# Altium schematic sheet Board_PB_LED.SchDoc
size A4
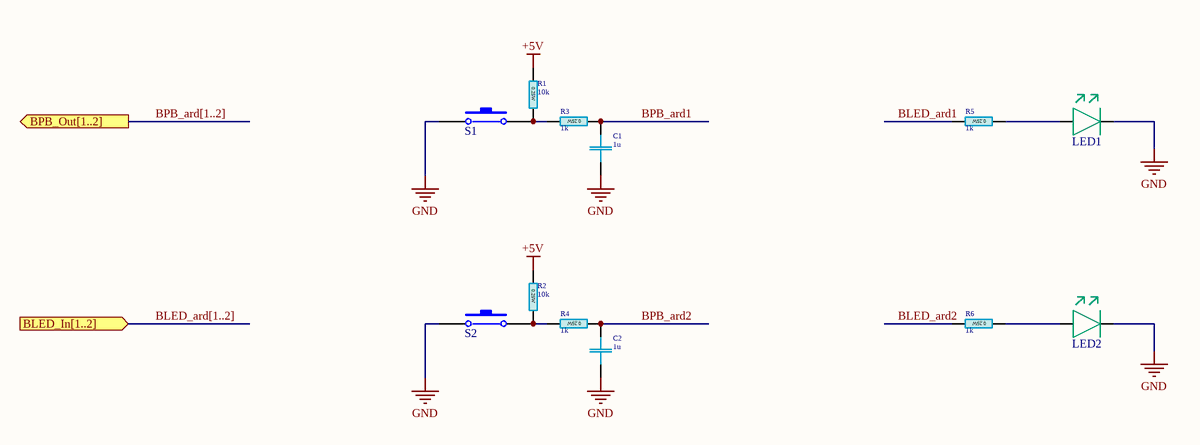
[diagram p0: Board_PB_LED.SchDoc]

## Parts
C1  1u  [C1206]
C2  1u  [C1206]
LED1  LED  [LED 1206]  (value not drawn)
LED2  LED  [LED 1206]  (value not drawn)
R1  10k  [R1206]
R2  10k  [R1206]
R3  1k  [R1206]
R4  1k  [R1206]
R5  1k  [R1206]
R6  1k  [R1206]
S1  PB-2pin  [PB-2pin]  (value not drawn)
S2  PB-2pin  [PB-2pin]  (value not drawn)

## Ports
BLED_In[1..2] (in), BPB_Out[1..2] (out)

## Nets
+5V: R1.1 R2.1
GND: C1.2 C2.2 LED1.K LED2.K S1.1 S2.1
BLED_ard1: R5.2
BLED_ard2: R6.2
BPB_ard1: C1.1 R3.1
BPB_ard2: C2.1 R4.1
NetLED1_A: LED1.A R5.1
NetLED2_A: LED2.A R6.1
NetR1_2: R1.2 R3.2 S1.2
NetR2_2: R2.2 R4.2 S2.2

## Buses and harness runs
bus BLED_ard[1..2] = port BLED_In[1..2]
bus BPB_ard[1..2] = port BPB_Out[1..2]

## Library data of the parts
C1 C2 = C 1206  100V X7R - 100n: SMD 1206   100V X7R 10%; Part Number: CL31B104KCFNNNE; Manufacturer: Samsung; TYPE: Capacitors; Package-mm: 3216; Mount Type: SMT; Publisher: Hefest; Manufacturer Alternate: *; Part Number Alternate: *; Published: 07.04.2019; Supplier 1: Comet; Supplier Part Number 1: C1206 100nF 100V X7R SAMSUNG; RoHS: Y; Technology: Ceramic  MLCC; Package: 1206; VDC: 100V; TempCo: X7R; Tolerance %: ±10%; VAC: *; ESR Ohm: *; ComponentLink1Description: Datasheet Link; ComponentLink1URL: https://store.comet.bg/download-file.php?id=11; Temperature Range: -55°C ~ +125°C; Price: 0.090; ComponentLink2Description: Characteristics data; ComponentLink2URL: https://store.comet.bg/download-file.php?id=3821; Value: 1u
R1-R6 = R 1206-5%: SMD 1206 0.25W   5% 200V; Manufacturer: YAGEO; TempCo: ±100ppm/°C; Package-mm: 3216; Value Code: 102; Part Number: *; Mount Type: SMT; Publisher: Hefest; Manufacturer Alternate: *; Published: 07.04.2019; Supplier 1: Comet; Supplier Part Number 1: R1206 1.0K 5% YAG/ASJ; RoHS: Y; Technology: Thick film; Package: 1206; VDC: 200V; Tolerance %: ±5%; ComponentLink1Description: Datasheet Link; ComponentLink1URL: https://store.comet.bg/download-file.php?id=140; Temperature Range: -55°C ~ +155°C; Price: 0.054; Part Number Alternate: *; TYPE: Resistor; Power: 0.25W
  R1 R2: Value: 10k
  R3-R6: Value: 1k
S1 S2 = PB-2pin: Switch; E-mail: picpars@gmail.com; Designer: Seyed Mohsen Ghasemian; Publisher: www.picpars.com; WEB: www.picpars.com